# Altium schematic sheet Sheet1_Young.SchDoc
size A4
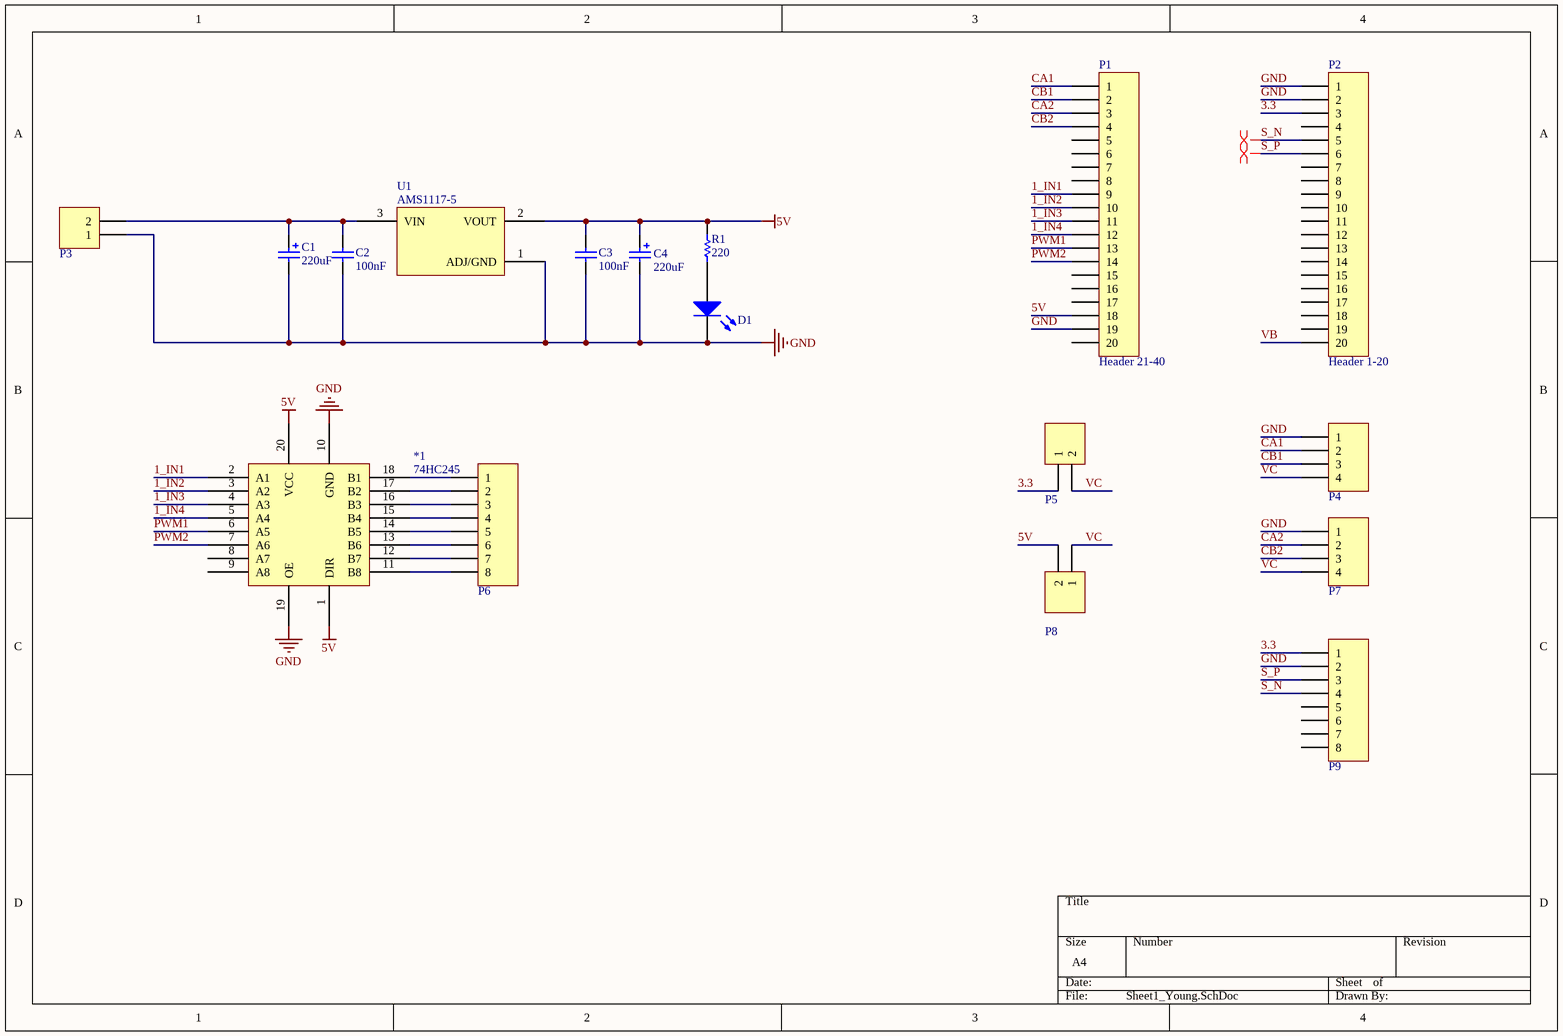
[diagram p0: Sheet1_Young.SchDoc]

## Parts
*1  74HC245  [TSOP65P630X120-20N]
C1  value 220uF  [CAP ALU SIZE B]  (hidden comment: Cap Pol SMD)
C2  value 100nF  [CAP-SM-0805]  (hidden comment: Cap Non-Pol SMD)
C3  value 100nF  [CAP-SM-0805]  (hidden comment: Cap Non-Pol SMD)
C4  value 220uF  [CAP ALU SIZE B]  (hidden comment: Cap Pol SMD)
D1  LED SMD  [LED_0805_Blue]  (value not drawn)
P1  Header 21-40  [HDR1X20]
P2  Header 1-20  [HDR1X20]
P3  Header 2  [JP2]  (value not drawn)
P4  Header 4  [JP4]  (value not drawn)
P5  Header 2  [JP2]  (value not drawn)
P6  Header 8  [JP8]  (value not drawn)
P7  Header 4  [JP4]  (value not drawn)
P8  Header 2  [JP2]  (value not drawn)
P9  Header 8  [JP8]  (value not drawn)
R1  value 220  [RES-SM-0805]  (hidden comment: RESISTOR SMD)
U1  AMS1117-5  [SOT230P700X180-4N]

## Nets
5V: *1.1(DIR) *1.20(VCC) C3.1 C4.1 P1.18 P8.2 R1.2 U1.2(VOUT)
GND: *1.10(GND) *1.19(OE) C1.2 C2.1 C3.2 C4.2 D1.2(K) P1.19 P2.1 P2.2 P3.1 P4.1 P7.1 P9.2 U1.1(ADJ/GND)
1_IN1: *1.2(A1) P1.9
1_IN2: *1.3(A2) P1.10
1_IN3: *1.4(A3) P1.11
1_IN4: *1.5(A4) P1.12
3.3: P2.3 P5.1 P9.1
CA1: P1.1 P4.2
CA2: P1.3 P7.2
CB1: P1.2 P4.3
CB2: P1.4 P7.3
PWM1: *1.6(A5) P1.13
PWM2: *1.7(A6) P1.14
S_N: P2.5 P9.4
S_P: P2.6 P9.3
VB: P2.20
VC: P4.4 P5.2 P7.4 P8.1
Net*1_11: *1.11(B8) P6.8
Net*1_12: *1.12(B7) P6.7
Net*1_13: *1.13(B6) P6.6
Net*1_14: *1.14(B5) P6.5
Net*1_15: *1.15(B4) P6.4
Net*1_16: *1.16(B3) P6.3
Net*1_17: *1.17(B2) P6.2
Net*1_18: *1.18(B1) P6.1
NetC1_1: C1.1 C2.2 P3.2 U1.3(VIN)
NetD1_1: D1.1(A) R1.1

Not connected (* = marked no-connect by the designer): *1 8(A7) 9(A8); P1 5 6 7 8 15 16 17 20; P2 4 7 8 9 10 11 12 13 14 15 16 17 18 19; P9 5 6 7 8

## Layout directives
differential pair: S_N, S_P

## Library data of the parts
C1 C4 = Cap Pol SMD: Polarized Capacitor (Radial)
C2 C3 = Cap Non-Pol SMD: Capacitor
D1 = LED SMD: LED
P1 P2 = Header 20: Header, 20-Pin; LatestRevisionDate: 17-Jul-2002; LatestRevisionNote: Re-released for DXP Platform.; Publisher: Altium Limited
P3 P5 P8 = Header 2: Header, 2-Pin; LatestRevisionDate: 17-Jul-2002; LatestRevisionNote: Re-released for DXP Platform.; Publisher: Altium Limited
P4 P7 = Header 4: Header, 4-Pin; LatestRevisionDate: 17-Jul-2002; LatestRevisionNote: Re-released for DXP Platform.; Publisher: Altium Limited
P6 P9 = Header 8: Header, 8-Pin; LatestRevisionDate: 17-Jul-2002; LatestRevisionNote: Re-released for DXP Platform.; Publisher: Altium Limited
R1 = RESISTOR SMD: Resistor
U1 = AMS1117-3.3: MF: NEC; Price: None; SnapEDA_Link: https://www.snapeda.com/parts/AMS1117-3.3/NEC/view-part/?ref=snap; Availability: Unavailable; MP: AMS1117-3.3; Package: None; Value: *